# Altium schematic sheet 2xparallelswitch_HALT.SchDoc: RP2040 CNC
size B; Author: AM; CompanyName: Expatria Technologies; DrawnBy: A.Marles; Engineer: AM; Organization: Expatria Technolgoies; DocumentNumber: 13; SheetNumber: 13; SheetTotal: 14
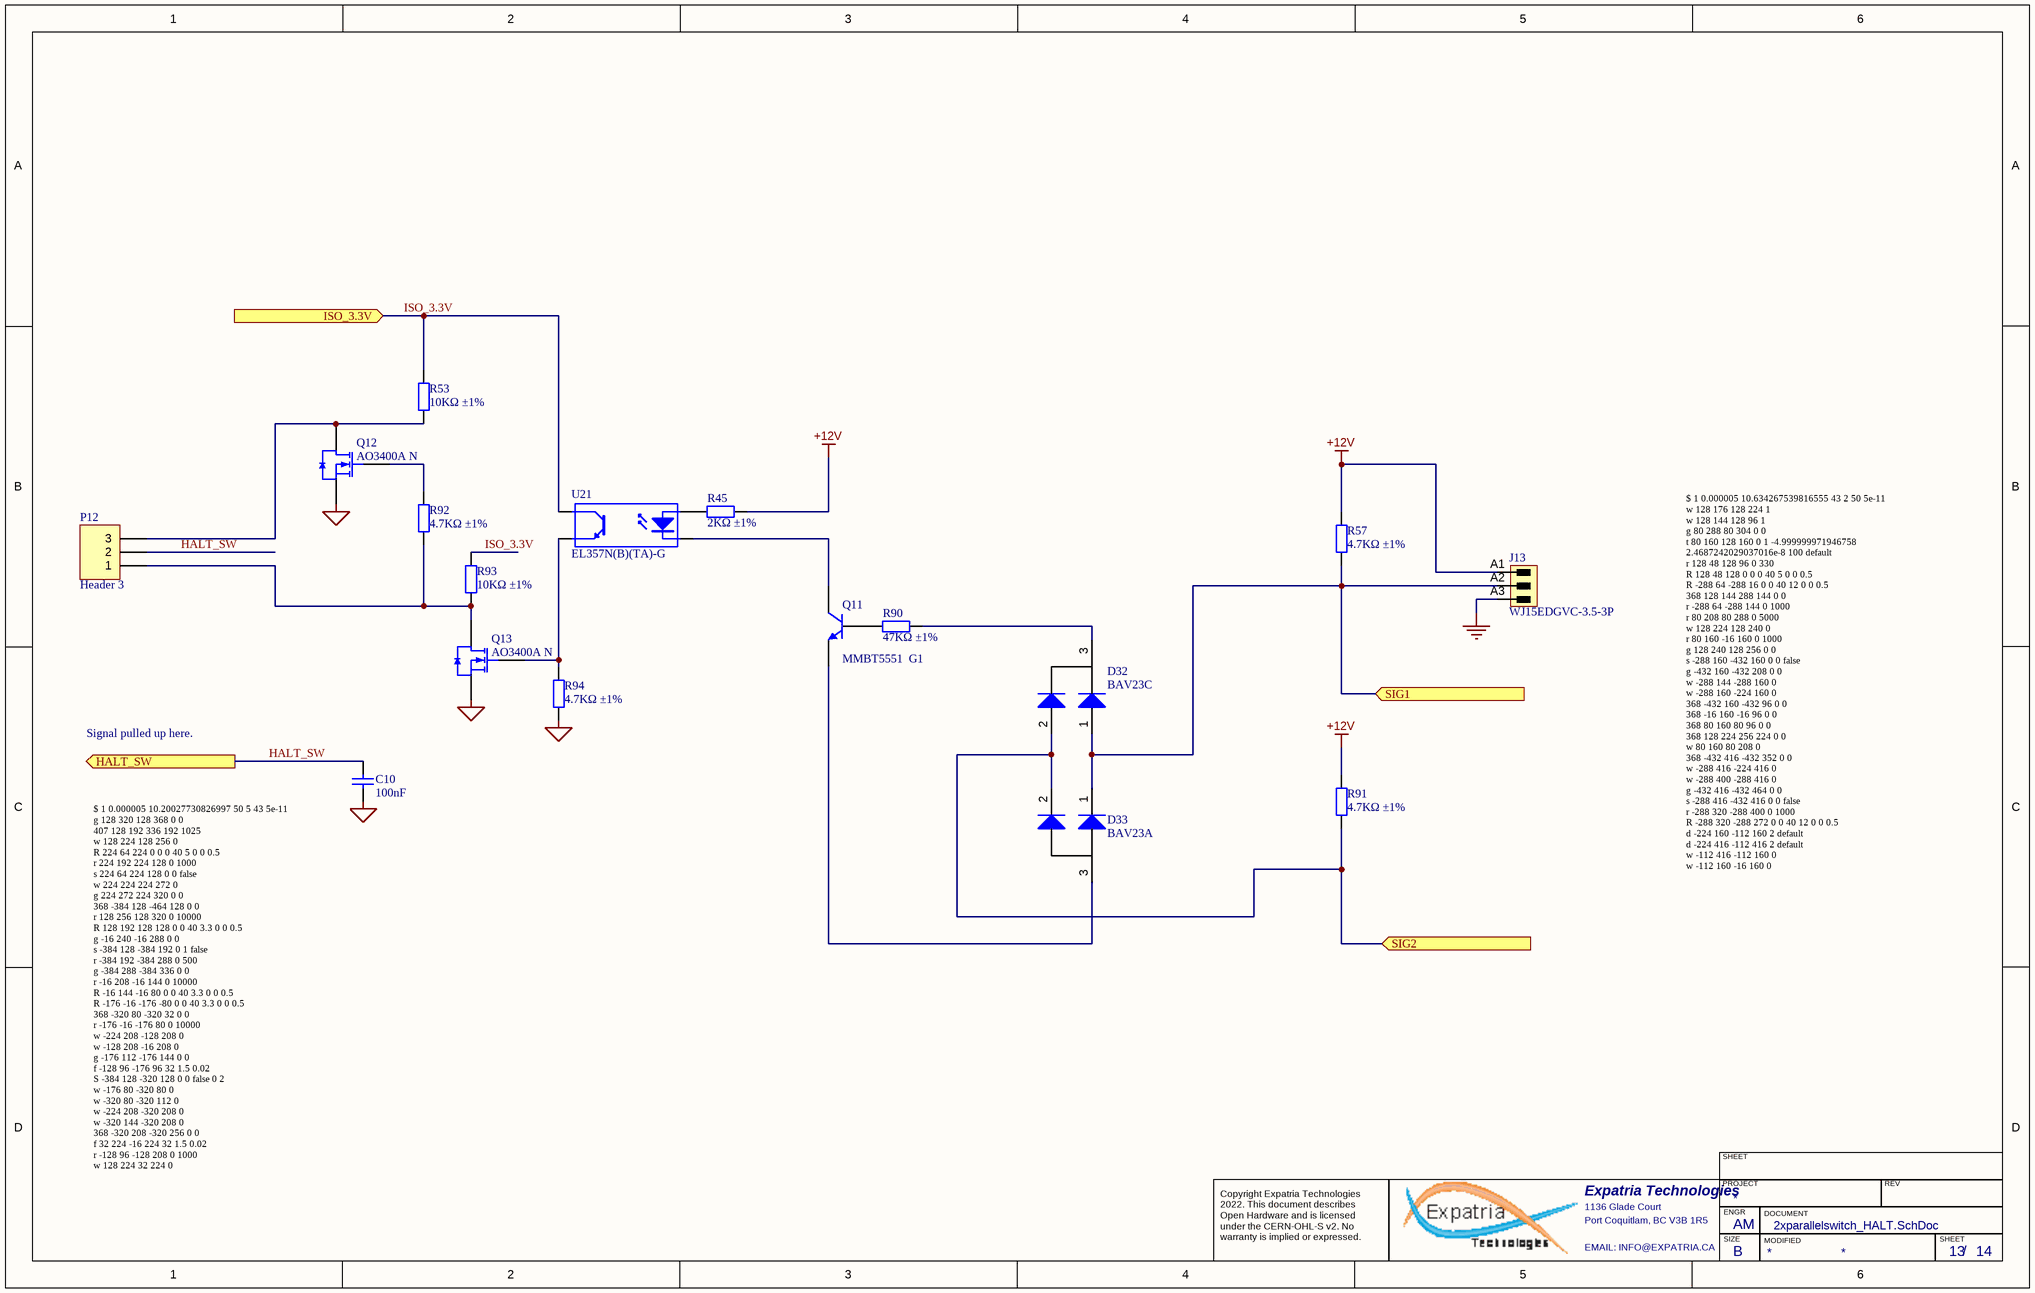
[diagram p0: 2xparallelswitch_HALT.SchDoc]

## Parts
C10  100nF  [0603_C]
D32  BAV23C  [SOT-23(SOT-23-3)]
D33  BAV23A  [SOT-23(SOT-23-3)]
J13  WJ15EDGVC-3.5-3P  [691321100003 - 3.5mm  3p]
P12  Header 3  [HDR1X3]
Q11  MMBT5551  G1  [SOT-23(SOT-23-3)]
Q12  AO3400A N  [SOT-23-3L]
Q13  AO3400A N  [SOT-23-3L]
R45  2KΩ ±1%  [0603_R]
R53  10KΩ ±1%  [0603_R]
R57  4.7KΩ ±1%  [0603_R]
R90  47KΩ ±1%  [0603_R]
R91  4.7KΩ ±1%  [0603_R]
R92  4.7KΩ ±1%  [0603_R]
R93  10KΩ ±1%  [0603_R]
R94  4.7KΩ ±1%  [0603_R]
U21  EL357N(B)(TA)-G  [SOP-4_P2.54]

## Ports
HALT_SW (out), ISO_3.3V (in), SIG1 (in), SIG2 (in)

## Nets
+12V: J13.A1 R45.2 R57.2 R91.2
GND: J13.A3
MCU_GND: C10.1 Q12.2(S) Q13.2(S) R94.1
HALT_SW: C10.2 P12.2 ; port HALT_SW
ISO_3.3V: R53.2 R93.2 U21.4(C) ; port ISO_3.3V
SIG1: D32.1(A) D33.1(K) J13.A2 R57.1 ; port SIG1
SIG2: D32.2(A) D33.2(K) R91.1 ; port SIG2
NetD32_3: D32.3(K) R90.1
NetD33_3: D33.3(A) Q11.2(E)
NetP12_1: P12.1 Q13.3(D) R92.1 R93.1
NetP12_3: P12.3 Q12.3(D) R53.1
NetQ11_1: Q11.1(B) R90.2
NetQ11_3: Q11.3(C) U21.2(K)
NetQ12_1: Q12.1(G) R92.2
NetQ13_1: Q13.1(G) R94.2 U21.3(E)
NetR45_1: R45.1 U21.1(A)

## Notes on the sheet
- Signal pulled up here.
- $ 1 0.000005 10.634267539816555 43 2 50 5e-11
  w 128 176 128 224 1
  w 128 144 128 96 1
  g 80 288 80 304 0 0
  t 80 160 128 160 0 1 -4.999999971946758 2.4687242029037016e-8 100 default
  r 128 48 128 96 0 330
  R 128 48 128 0 0 0 40 5 0 0 0.5
  R -288 64 -288 16 0 0 40 12 0 0 0.5
  368 128 144 288 144 0 0
  r -288 64 -288 144 0 1000
  r 80 208 80 288 0 5000
  w 128 224 128 240 0
  r 80 160 -16 160 0 1000
  g 128 240 128 256 0 0
  s -288 160 -432 160 0 0 false
  g -432 160 -432 208 0 0
  w -288 144 -288 160 0
  w -288 160 -224 160 0
  368 -432 160 -432 96 0 0
  368 -16 160 -16 96 0 0
  368 80 160 80 96 0 0
  368 128 224 256 224 0 0
  w 80 160 80 208 0
  368 -432 416 -432 352 0 0
  w -288 416 -224 416 0
  w -288 400 -288 416 0
  g -432 416 -432 464 0 0
  s -288 416 -432 416 0 0 false
  r -288 320 -288 400 0 1000
  R -288 320 -288 272 0 0 40 12 0 0 0.5
  d -224 160 -112 160 2 default
  d -224 416 -112 416 2 default
  w -112 416 -112 160 0
  w -112 160 -16 160 0
- (near C10) $ 1 0.000005 10.20027730826997 50 5 43 5e-11
  g 128 320 128 368 0 0
  407 128 192 336 192 1025
  w 128 224 128 256 0
  R 224 64 224 0 0 0 40 5 0 0 0.5
  r 224 192 224 128 0 1000
  s 224 64 224 128 0 0 false
  w 224 224 224 272 0
  g 224 272 224 320 0 0
  368 -384 128 -464 128 0 0
  r 128 256 128 320 0 10000
  R 128 192 128 128 0 0 40 3.3 0 0 0.5
  g -16 240 -16 288 0 0
  s -384 128 -384 192 0 1 false
  r -384 192 -384 288 0 500
  g -384 288 -384 336 0 0
  r -16 208 -16 144 0 10000
  R -16 144 -16 80 0 0 40 3.3 0 0 0.5
  R -176 -16 -176 -80 0 0 40 3.3 0 0 0.5
  368 -320 80 -320 32 0 0
  r -176 -16 -176 80 0 10000
  w -224 208 -128 208 0
  w -128 208 -16 208 0
  g -176 112 -176 144 0 0
  f -128 96 -176 96 32 1.5 0.02
  S -384 128 -320 128 0 0 false 0 2
  w -176 80 -320 80 0
  w -320 80 -320 112 0
  w -224 208 -320 208 0
  w -320 144 -320 208 0
  368 -320 208 -320 256 0 0
  f 32 224 -16 224 32 1.5 0.02
  r -128 96 -128 208 0 1000
  w 128 224 32 224 0
- SHEET
- Expatria Technologies
- 1136 Glade Court
- Port Coquitlam, BC V3B 1R5
- PROJECT
- SIZE
- ENGR
- MODIFIED
- DOCUMENT
- REV
- Copyright Expatria Technologies 2022. This document describes Open Hardware and is licensed under the CERN-OHL-S v2. No warranty is implied or expressed.
- EMAIL: INFO@EXPATRIA.CA
- B
- /

## Library data of the parts
C10 = 0603 100nF (104) 10% 50V: Chip capacitors; Manufacturer: YAGEO; PartNumber: CC0603KRX7R9BB104; Tolerance: 10%; Voltage: 50V; ComponentLink1Description: Supplier link; ComponentLink1URL: http://www.szlcsc.com/product/details_15331.html; Package: 0603; Supplier: LC; SuppliersPartNumber: C14663; Capacitance: 100nF
D32 = SOT-23 BAV23C: 250V +150℃@(Tj) 350mW Dual Common Cathode 1.25V@200mA 50ns 100nA@250V 225mA SOT-23 Switching Diode ROHS; ComponentLink1Description: 供应商链接; ComponentLink1URL: http://www.szlcsc.com/product/details_70091.html; Package: SOT-23; Supplier: LC; SuppliersPartNumber: C545540
D33 = SOT-23 BAV23A: 200V -65℃~+150℃@(Tj) 350mW 1 Pair Common Anode 1.25V@200mA 50ns 100nA@200V 400mA SOT-23 Switching Diode ROHS; ComponentLink1Description: 供应商链接; ComponentLink1URL: http://www.szlcsc.com/product/details_70091.html; Package: SOT-23; Supplier: LC; SuppliersPartNumber: C328584
J13 = 3.5mm Terminal Header 3p: Header,Male Pin,Covered(4 Sided) 3 1 0.138"（3.50mm） 3 P=3.5mm Pluggable System Terminal Block RoHS; Manufacturer: Weidmueller; Manufacturer 1: Weidmuller; Manufacturer Part Number 1: 1604480000; Pitch_mm: 3.5 mm; UL_94_flammability_rating: V-0; Side_termination_characteristic: closed side; Solder_pin_length_mm: 3.2 mm; Short_text_for_material: SL 3.50/03/180G 3.2SN OR BX; Pitch_inch: 0.138 inch; PartNumber: WJ15EDGVC-3.5-3P; PackageReference: SL_3_50_180G_03; ComponentLink1URL: http://www.weidmueller.com/; ComponentLink1Description: Manufacturer URL; Packaging: Box; Revision: V1; SuppliersPartNumber: C192778
P12 = Header 3: Header, 3-Pin; Publisher: Altium Limited; SuppliersPartNumber: C49257
Q11 = SOT-23 MMBT5551  G1: 三极管; ComponentLink1Description: 供应商链接; ComponentLink1URL: http://www.szlcsc.com/product/details_2502.html; Package: SOT-23; Supplier: LC; SuppliersPartNumber: C2145
Q12 Q13 = AO3400A N道沟 X0YV1T SOT-23: MOS(场效应管); ComponentLink1Description: 供应商链接; ComponentLink1URL: http://www.szlcsc.com/product/details_21629.html; Package: SOT-23; Supplier: LC; SuppliersPartNumber: C20917
R45 = 0603 2K (2001) 1%: Chip resistor; Manufacturer: Uniroyal Elec; PartNumber: 0603WAF2001T5E; Power: 1/10W; ComponentLink1Description: Supplier link; ComponentLink1URL: http://www.szlcsc.com/product/details_23702.html; Package: 0603; Supplier: LC; SuppliersPartNumber: C22975; Resistance: 2KΩ; Tolerance: 1%
R53 R93 = 0603 10K (1002) 1%: Chip resistor; Manufacturer: Uniroyal Elec; PartNumber: 0603WAF1002T5E; Power: 1/10W; ComponentLink1Description: Supplier link; ComponentLink1URL: http://www.szlcsc.com/product/details_26547.html; Package: 0603; Supplier: LC; SuppliersPartNumber: C25804; Resistance: 10KΩ; Tolerance: 1%
R57 R91 R92 R94 = 0603 4.7K (4701) 1%: Chip resistor; Manufacturer: Uniroyal Elec; PartNumber: 0603WAF4701T5E; Power: 1/10W; ComponentLink1Description: Supplier link; ComponentLink1URL: http://www.szlcsc.com/product/details_23889.html; Package: 0603; Supplier: LC; SuppliersPartNumber: C23162; Resistance: 4.7KΩ; Tolerance: 1%
R90 = 0603 47K (4702) 1%: Chip resistor; Manufacturer: Uniroyal Elec; PartNumber: 0603WAF4702T5E; Power: 1/10W; ComponentLink1Description: Supplier link; ComponentLink1URL: http://www.szlcsc.com/product/details_26562.html; Package: 0603; Supplier: LC; SuppliersPartNumber: C25819; Resistance: 47KΩ; Tolerance: 1%
U21 = EL357N(B)(TA)-G_[C6649]: 贴片光耦; ComponentLink1Description: 供应商链接; ComponentLink1URL: http://www.szlcsc.com/product/details_7114.html; Package: SOP-4_P2.54; Supplier: LC; SuppliersPartNumber: C6649